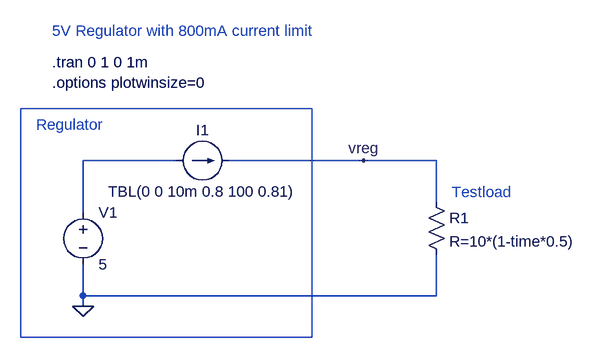
[diagram p0: schematic Reg_5V_800mA.asc]
Reg_5V_800mA.asc, the LTspice schematic file:
Version 4
SHEET 1 880 680
WIRE 160 0 16 0
WIRE 448 0 240 0
WIRE 560 0 448 0
WIRE 560 64 560 0
WIRE 16 80 16 0
WIRE 16 208 16 160
WIRE 560 208 560 144
WIRE 560 208 16 208
WIRE 16 224 16 208
FLAG 16 224 0
FLAG 448 0 vreg
SYMBOL voltage 16 64 R0
WINDOW 123 0 0 Left 0
WINDOW 39 0 0 Left 0
SYMATTR InstName V1
SYMATTR Value 5
SYMBOL current 160 0 R270
WINDOW 0 32 40 VTop 0
WINDOW 3 -32 40 VBottom 0
WINDOW 123 0 0 Left 0
WINDOW 39 0 0 Left 0
SYMATTR InstName I1
SYMATTR Value TBL(0 0 10m 0.8 100 0.81)
SYMBOL res 544 48 R0
SYMATTR InstName R1
SYMATTR Value R=10*(1-time*0.5)
TEXT -32 -152 Left 0 !.tran 0 1 0 1m
TEXT -32 -120 Left 0 !.options plotwinsize=0
TEXT -32 -200 Left 0 ;5V Regulator with 800mA current limit
TEXT -56 -56 Left 0 ;Regulator
TEXT 584 48 Left 0 ;Testload
RECTANGLE Normal 368 272 -80 -80

The netlist it stands for:
* Reg_5V_800mA.asc
V1 N001 0 5
I1 N001 vreg TBL(0 0 10m 0.8 100 0.81)
R1 vreg 0 R=10*(1-time*0.5)
.tran 0 1 0 1m
.options plotwinsize=0
* 5V Regulator with 800mA current limit
* Regulator
* Testload
.backanno
.end